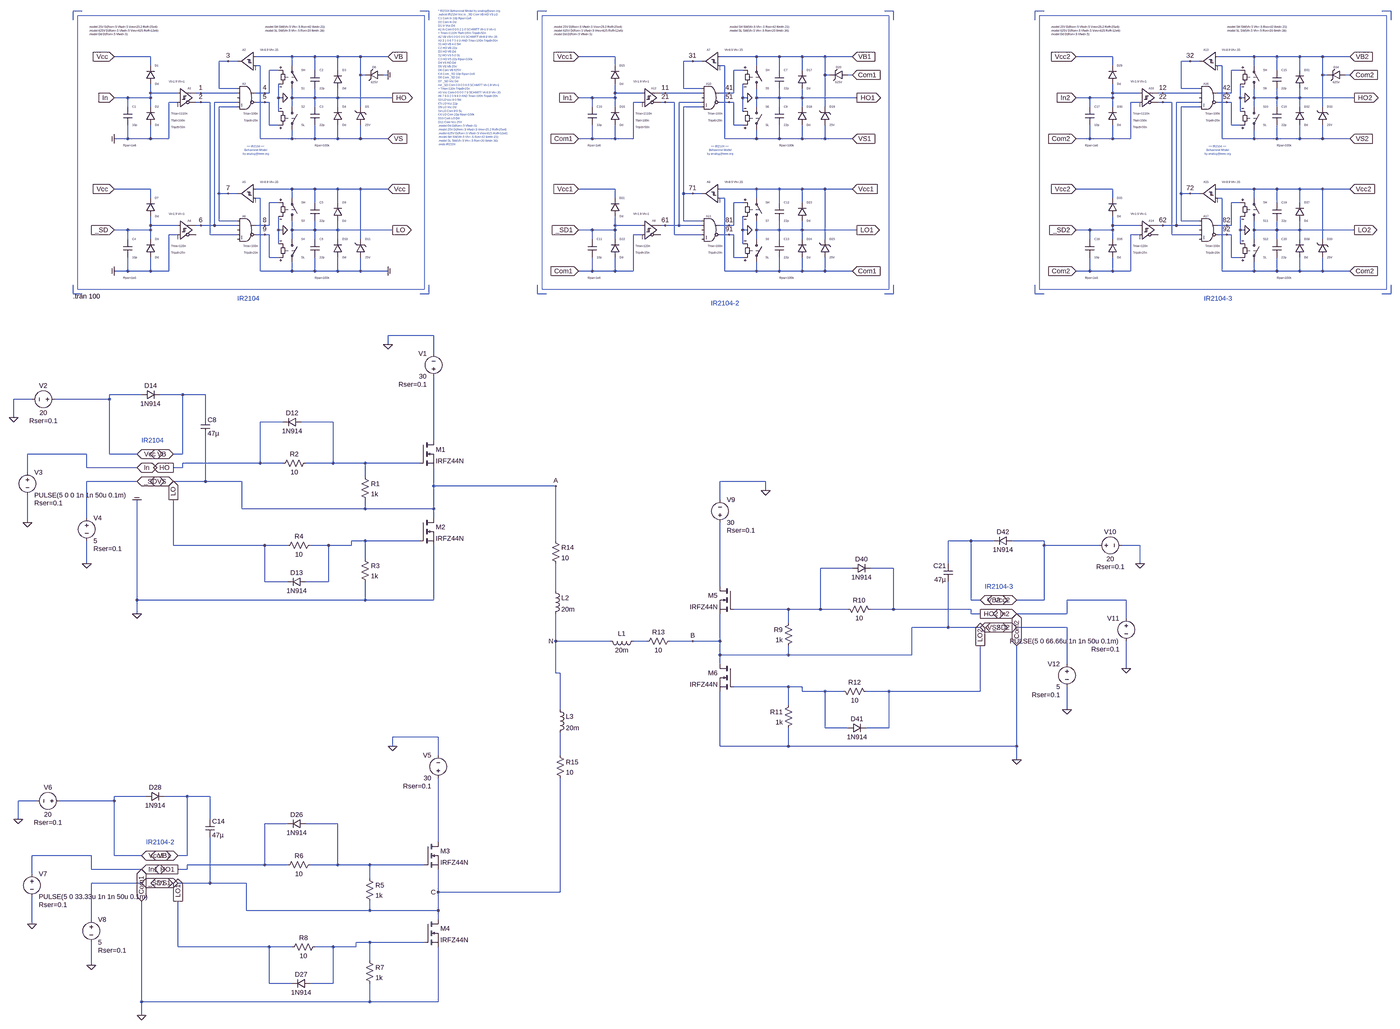
[diagram p0: schematic IR2104_11son hal.asc, whole sheet]
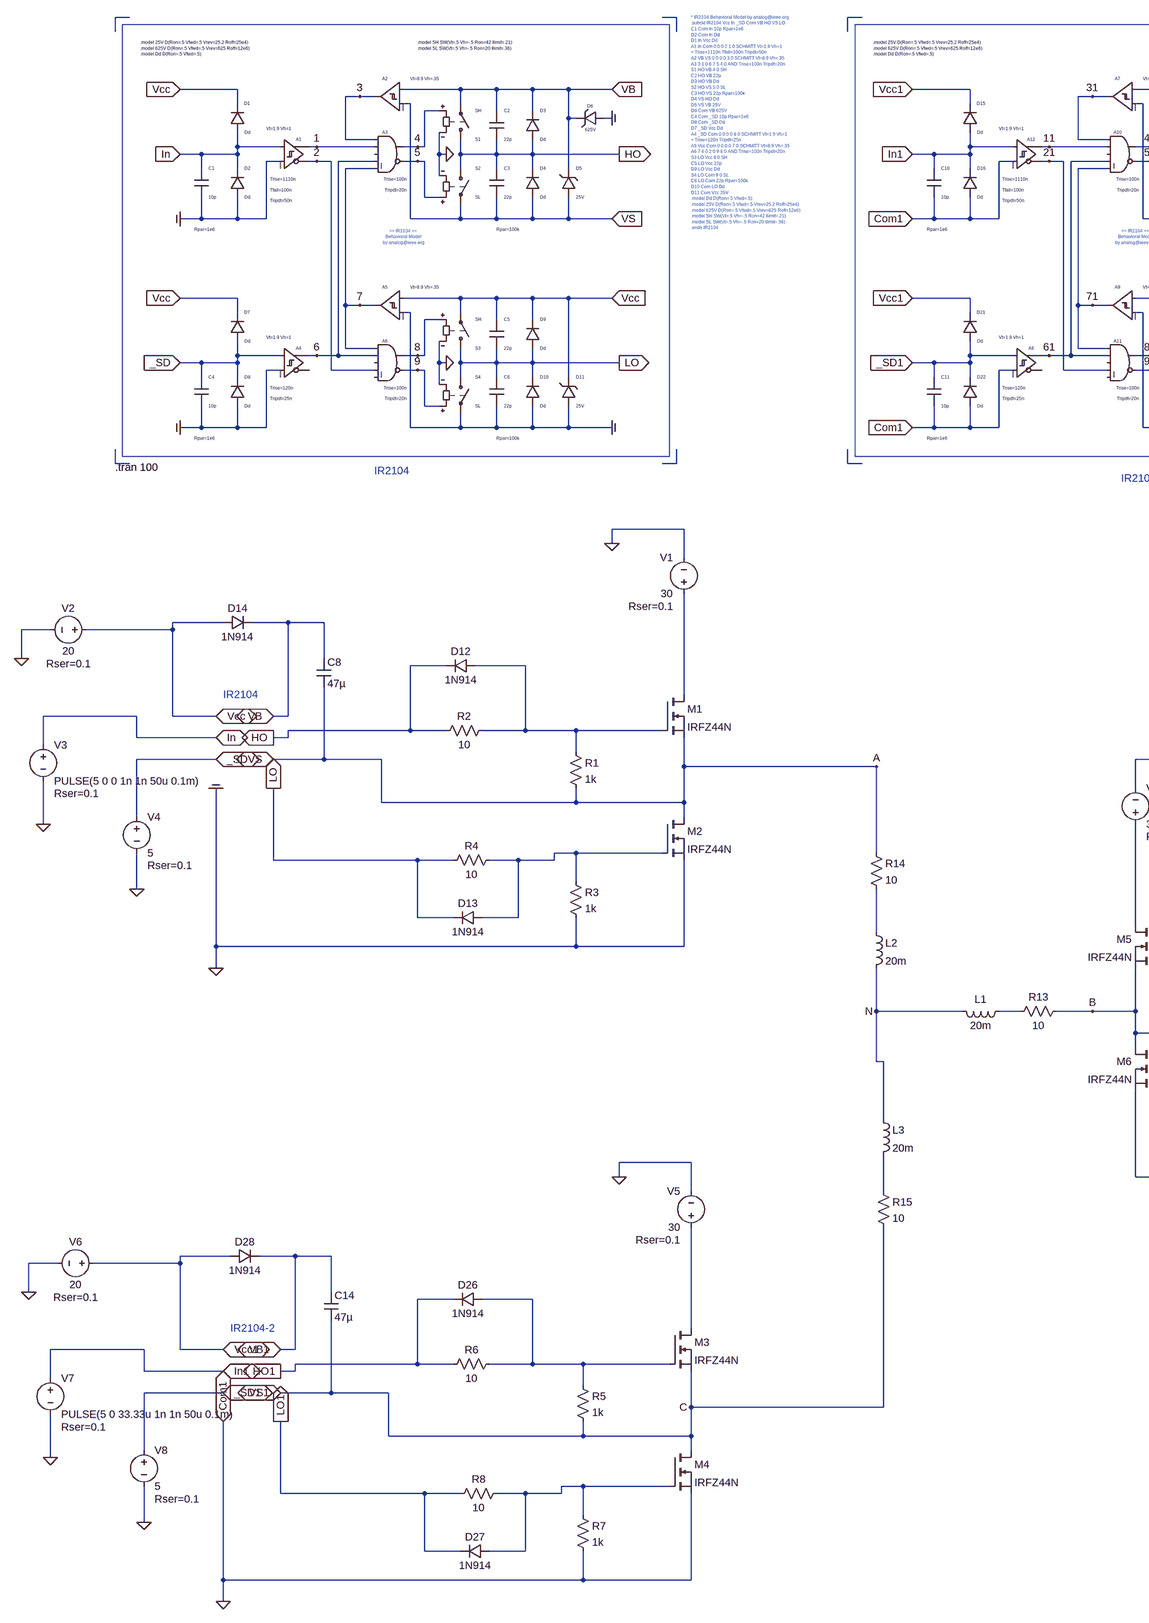
[diagram p1: schematic IR2104_11son hal.asc, part, row 1 of 1, column 1 of 2]
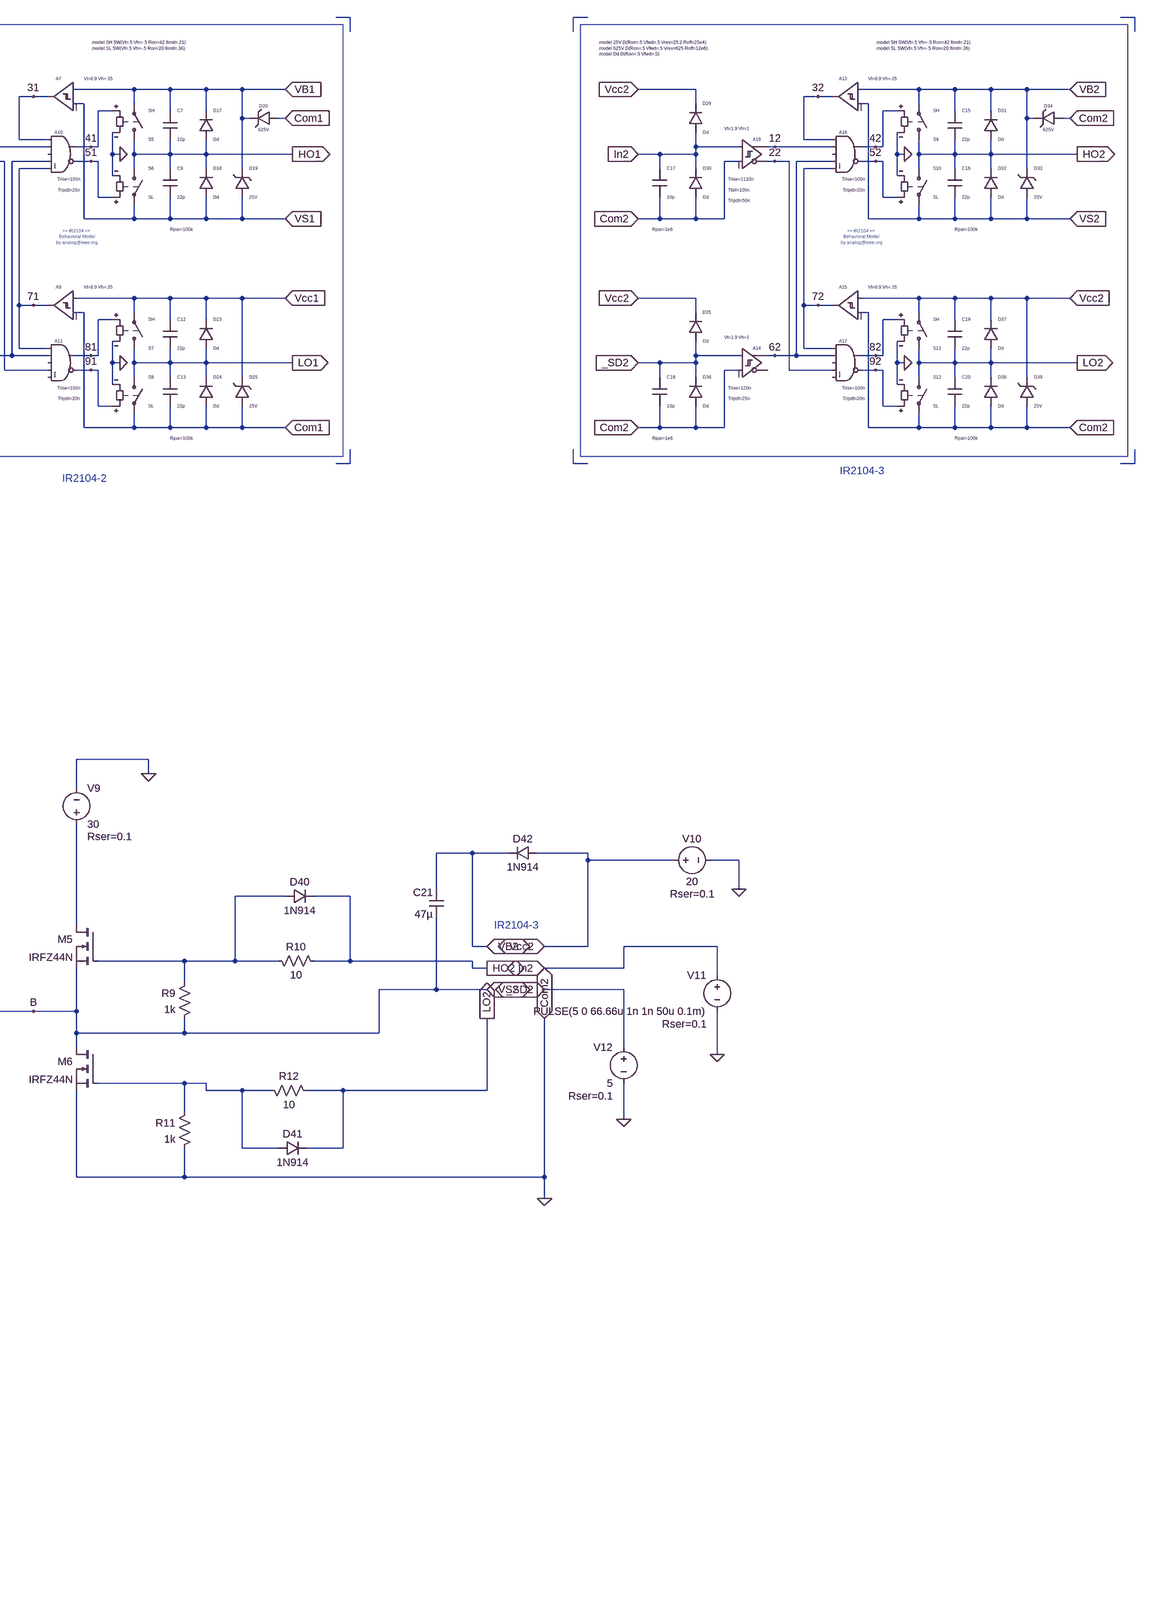
[diagram p2: schematic IR2104_11son hal.asc, part, row 1 of 1, column 2 of 2]
IR2104_11son hal.asc, the LTspice schematic file:
Version 4.1
SHEET 1 4404 2996
WIRE -368 -592 -400 -592
WIRE 848 -592 816 -592
WIRE 1440 -592 1408 -592
WIRE 2656 -592 2624 -592
WIRE 3184 -592 3152 -592
WIRE 4400 -592 4368 -592
WIRE -400 -560 -400 -592
WIRE 848 -560 848 -592
WIRE 1408 -560 1408 -592
WIRE 2656 -560 2656 -592
WIRE 3152 -560 3152 -592
WIRE 4400 -560 4400 -592
WIRE -128 -432 -256 -432
WIRE 368 -432 240 -432
WIRE 448 -432 368 -432
WIRE 528 -432 448 -432
WIRE 608 -432 528 -432
WIRE 704 -432 608 -432
WIRE 1680 -432 1552 -432
WIRE 2176 -432 2048 -432
WIRE 2256 -432 2176 -432
WIRE 2336 -432 2256 -432
WIRE 2416 -432 2336 -432
WIRE 2512 -432 2416 -432
WIRE 3424 -432 3296 -432
WIRE 3920 -432 3792 -432
WIRE 4000 -432 3920 -432
WIRE 4080 -432 4000 -432
WIRE 4160 -432 4080 -432
WIRE 4256 -432 4160 -432
WIRE 144 -416 112 -416
WIRE 176 -416 144 -416
WIRE 1952 -416 1920 -416
WIRE 1984 -416 1952 -416
WIRE 3696 -416 3664 -416
WIRE 3728 -416 3696 -416
WIRE -128 -400 -128 -432
WIRE 256 -400 240 -400
WIRE 368 -400 368 -432
WIRE 1680 -400 1680 -432
WIRE 2064 -400 2048 -400
WIRE 2176 -400 2176 -432
WIRE 3424 -400 3424 -432
WIRE 3808 -400 3792 -400
WIRE 3920 -400 3920 -432
WIRE 320 -384 288 -384
WIRE 448 -384 448 -432
WIRE 528 -384 528 -432
WIRE 2128 -384 2096 -384
WIRE 2256 -384 2256 -432
WIRE 2336 -384 2336 -432
WIRE 3872 -384 3840 -384
WIRE 4000 -384 4000 -432
WIRE 4080 -384 4080 -432
WIRE 608 -368 608 -432
WIRE 624 -368 608 -368
WIRE 704 -368 688 -368
WIRE 2416 -368 2416 -432
WIRE 2432 -368 2416 -368
WIRE 2512 -368 2496 -368
WIRE 4160 -368 4160 -432
WIRE 4176 -368 4160 -368
WIRE 4256 -368 4240 -368
WIRE 112 -320 112 -416
WIRE 176 -320 112 -320
WIRE 1920 -320 1920 -416
WIRE 1984 -320 1920 -320
WIRE 3664 -320 3664 -416
WIRE 3728 -320 3664 -320
WIRE -128 -304 -128 -336
WIRE -32 -304 -128 -304
WIRE 48 -304 32 -304
WIRE 176 -304 48 -304
WIRE 272 -304 240 -304
WIRE 288 -304 288 -384
WIRE 288 -304 272 -304
WIRE 1680 -304 1680 -336
WIRE 1776 -304 1680 -304
WIRE 1856 -304 1840 -304
WIRE 1984 -304 1856 -304
WIRE 2080 -304 2048 -304
WIRE 2096 -304 2096 -384
WIRE 2096 -304 2080 -304
WIRE 3424 -304 3424 -336
WIRE 3520 -304 3424 -304
WIRE 3600 -304 3584 -304
WIRE 3728 -304 3600 -304
WIRE 3824 -304 3792 -304
WIRE 3840 -304 3840 -384
WIRE 3840 -304 3824 -304
WIRE -208 -288 -256 -288
WIRE -128 -288 -128 -304
WIRE -128 -288 -208 -288
WIRE 320 -288 320 -336
WIRE 336 -288 320 -288
WIRE 368 -288 368 -320
WIRE 448 -288 448 -320
WIRE 448 -288 368 -288
WIRE 528 -288 528 -320
WIRE 528 -288 448 -288
WIRE 720 -288 528 -288
WIRE 1600 -288 1552 -288
WIRE 1680 -288 1680 -304
WIRE 1680 -288 1600 -288
WIRE 2128 -288 2128 -336
WIRE 2144 -288 2128 -288
WIRE 2176 -288 2176 -320
WIRE 2256 -288 2256 -320
WIRE 2256 -288 2176 -288
WIRE 2336 -288 2336 -320
WIRE 2336 -288 2256 -288
WIRE 2528 -288 2336 -288
WIRE 3344 -288 3296 -288
WIRE 3424 -288 3424 -304
WIRE 3424 -288 3344 -288
WIRE 3872 -288 3872 -336
WIRE 3888 -288 3872 -288
WIRE 3920 -288 3920 -320
WIRE 4000 -288 4000 -320
WIRE 4000 -288 3920 -288
WIRE 4080 -288 4080 -320
WIRE 4080 -288 4000 -288
WIRE 4272 -288 4080 -288
WIRE -32 -272 -64 -272
WIRE 48 -272 32 -272
WIRE 80 -272 48 -272
WIRE 176 -272 96 -272
WIRE 272 -272 240 -272
WIRE 288 -272 272 -272
WIRE 1776 -272 1744 -272
WIRE 1856 -272 1840 -272
WIRE 1888 -272 1856 -272
WIRE 1984 -272 1904 -272
WIRE 2080 -272 2048 -272
WIRE 2096 -272 2080 -272
WIRE 3520 -272 3488 -272
WIRE 3600 -272 3584 -272
WIRE 3632 -272 3600 -272
WIRE 3728 -272 3648 -272
WIRE 3824 -272 3792 -272
WIRE 3840 -272 3824 -272
WIRE -208 -256 -208 -288
WIRE -128 -256 -128 -288
WIRE 176 -256 112 -256
WIRE 368 -256 368 -288
WIRE 448 -256 448 -288
WIRE 528 -256 528 -288
WIRE 608 -256 608 -368
WIRE 1600 -256 1600 -288
WIRE 1680 -256 1680 -288
WIRE 1984 -256 1920 -256
WIRE 2176 -256 2176 -288
WIRE 2256 -256 2256 -288
WIRE 2336 -256 2336 -288
WIRE 2416 -256 2416 -368
WIRE 3344 -256 3344 -288
WIRE 3424 -256 3424 -288
WIRE 3728 -256 3664 -256
WIRE 3920 -256 3920 -288
WIRE 4000 -256 4000 -288
WIRE 4080 -256 4080 -288
WIRE 4160 -256 4160 -368
WIRE 320 -240 320 -288
WIRE 2128 -240 2128 -288
WIRE 3872 -240 3872 -288
WIRE 288 -192 288 -272
WIRE 320 -192 288 -192
WIRE 2096 -192 2096 -272
WIRE 2128 -192 2096 -192
WIRE 3840 -192 3840 -272
WIRE 3872 -192 3840 -192
WIRE -208 -144 -208 -192
WIRE -208 -144 -256 -144
WIRE -128 -144 -128 -192
WIRE -128 -144 -208 -144
WIRE -64 -144 -64 -272
WIRE -64 -144 -128 -144
WIRE 256 -144 256 -400
WIRE 368 -144 368 -176
WIRE 368 -144 256 -144
WIRE 448 -144 448 -192
WIRE 448 -144 368 -144
WIRE 528 -144 528 -192
WIRE 528 -144 448 -144
WIRE 608 -144 608 -192
WIRE 608 -144 528 -144
WIRE 704 -144 608 -144
WIRE 1600 -144 1600 -192
WIRE 1600 -144 1552 -144
WIRE 1680 -144 1680 -192
WIRE 1680 -144 1600 -144
WIRE 1744 -144 1744 -272
WIRE 1744 -144 1680 -144
WIRE 2064 -144 2064 -400
WIRE 2176 -144 2176 -176
WIRE 2176 -144 2064 -144
WIRE 2256 -144 2256 -192
WIRE 2256 -144 2176 -144
WIRE 2336 -144 2336 -192
WIRE 2336 -144 2256 -144
WIRE 2416 -144 2416 -192
WIRE 2416 -144 2336 -144
WIRE 2512 -144 2416 -144
WIRE 3344 -144 3344 -192
WIRE 3344 -144 3296 -144
WIRE 3424 -144 3424 -192
WIRE 3424 -144 3344 -144
WIRE 3488 -144 3488 -272
WIRE 3488 -144 3424 -144
WIRE 3808 -144 3808 -400
WIRE 3920 -144 3920 -176
WIRE 3920 -144 3808 -144
WIRE 4000 -144 4000 -192
WIRE 4000 -144 3920 -144
WIRE 4080 -144 4080 -192
WIRE 4080 -144 4000 -144
WIRE 4160 -144 4160 -192
WIRE 4160 -144 4080 -144
WIRE 4256 -144 4160 -144
WIRE -128 32 -256 32
WIRE 368 32 240 32
WIRE 448 32 368 32
WIRE 528 32 448 32
WIRE 608 32 528 32
WIRE 704 32 608 32
WIRE 1680 32 1552 32
WIRE 2176 32 2048 32
WIRE 2256 32 2176 32
WIRE 2336 32 2256 32
WIRE 2416 32 2336 32
WIRE 2512 32 2416 32
WIRE 3424 32 3296 32
WIRE 3920 32 3792 32
WIRE 4000 32 3920 32
WIRE 4080 32 4000 32
WIRE 4160 32 4080 32
WIRE 4256 32 4160 32
WIRE 112 48 112 -256
WIRE 144 48 112 48
WIRE 176 48 144 48
WIRE 1920 48 1920 -256
WIRE 1952 48 1920 48
WIRE 1984 48 1952 48
WIRE 3664 48 3664 -256
WIRE 3696 48 3664 48
WIRE 3728 48 3696 48
WIRE -128 64 -128 32
WIRE 256 64 240 64
WIRE 368 64 368 32
WIRE 1680 64 1680 32
WIRE 2064 64 2048 64
WIRE 2176 64 2176 32
WIRE 3424 64 3424 32
WIRE 3808 64 3792 64
WIRE 3920 64 3920 32
WIRE 320 80 288 80
WIRE 448 80 448 32
WIRE 528 80 528 32
WIRE 2128 80 2096 80
WIRE 2256 80 2256 32
WIRE 2336 80 2336 32
WIRE 3872 80 3840 80
WIRE 4000 80 4000 32
WIRE 4080 80 4080 32
WIRE 112 144 112 48
WIRE 176 144 112 144
WIRE 1920 144 1920 48
WIRE 1984 144 1920 144
WIRE 3664 144 3664 48
WIRE 3728 144 3664 144
WIRE -128 160 -128 128
WIRE -32 160 -128 160
WIRE 48 160 32 160
WIRE 96 160 96 -272
WIRE 96 160 48 160
WIRE 176 160 96 160
WIRE 272 160 240 160
WIRE 288 160 288 80
WIRE 288 160 272 160
WIRE 1680 160 1680 128
WIRE 1776 160 1680 160
WIRE 1856 160 1840 160
WIRE 1904 160 1904 -272
WIRE 1904 160 1856 160
WIRE 1984 160 1904 160
WIRE 2080 160 2048 160
WIRE 2096 160 2096 80
WIRE 2096 160 2080 160
WIRE 3424 160 3424 128
WIRE 3520 160 3424 160
WIRE 3600 160 3584 160
WIRE 3648 160 3648 -272
WIRE 3648 160 3600 160
WIRE 3728 160 3648 160
WIRE 3824 160 3792 160
WIRE 3840 160 3840 80
WIRE 3840 160 3824 160
WIRE -208 176 -256 176
WIRE -128 176 -128 160
WIRE -128 176 -208 176
WIRE 320 176 320 128
WIRE 336 176 320 176
WIRE 368 176 368 144
WIRE 448 176 448 144
WIRE 448 176 368 176
WIRE 528 176 528 144
WIRE 528 176 448 176
WIRE 720 176 528 176
WIRE 1600 176 1552 176
WIRE 1680 176 1680 160
WIRE 1680 176 1600 176
WIRE 2128 176 2128 128
WIRE 2144 176 2128 176
WIRE 2176 176 2176 144
WIRE 2256 176 2256 144
WIRE 2256 176 2176 176
WIRE 2336 176 2336 144
WIRE 2336 176 2256 176
WIRE 2528 176 2336 176
WIRE 3344 176 3296 176
WIRE 3424 176 3424 160
WIRE 3424 176 3344 176
WIRE 3872 176 3872 128
WIRE 3888 176 3872 176
WIRE 3920 176 3920 144
WIRE 4000 176 4000 144
WIRE 4000 176 3920 176
WIRE 4080 176 4080 144
WIRE 4080 176 4000 176
WIRE 4272 176 4080 176
WIRE -32 192 -64 192
WIRE 80 192 80 -272
WIRE 176 192 80 192
WIRE 272 192 240 192
WIRE 288 192 272 192
WIRE 1776 192 1744 192
WIRE 1888 192 1888 -272
WIRE 1984 192 1888 192
WIRE 2080 192 2048 192
WIRE 2096 192 2080 192
WIRE 3520 192 3488 192
WIRE 3632 192 3632 -272
WIRE 3728 192 3632 192
WIRE 3824 192 3792 192
WIRE 3840 192 3824 192
WIRE -208 208 -208 176
WIRE -128 208 -128 176
WIRE 368 208 368 176
WIRE 448 208 448 176
WIRE 528 208 528 176
WIRE 608 208 608 32
WIRE 1600 208 1600 176
WIRE 1680 208 1680 176
WIRE 2176 208 2176 176
WIRE 2256 208 2256 176
WIRE 2336 208 2336 176
WIRE 2416 208 2416 32
WIRE 3344 208 3344 176
WIRE 3424 208 3424 176
WIRE 3920 208 3920 176
WIRE 4000 208 4000 176
WIRE 4080 208 4080 176
WIRE 4160 208 4160 32
WIRE 320 224 320 176
WIRE 2128 224 2128 176
WIRE 3872 224 3872 176
WIRE 288 272 288 192
WIRE 320 272 288 272
WIRE 2096 272 2096 192
WIRE 2128 272 2096 272
WIRE 3840 272 3840 192
WIRE 3872 272 3840 272
WIRE -208 320 -208 272
WIRE -208 320 -256 320
WIRE -128 320 -128 272
WIRE -128 320 -208 320
WIRE -64 320 -64 192
WIRE -64 320 -128 320
WIRE 256 320 256 64
WIRE 368 320 368 288
WIRE 368 320 256 320
WIRE 448 320 448 272
WIRE 448 320 368 320
WIRE 528 320 528 272
WIRE 528 320 448 320
WIRE 608 320 608 272
WIRE 608 320 528 320
WIRE 704 320 608 320
WIRE 1600 320 1600 272
WIRE 1600 320 1552 320
WIRE 1680 320 1680 272
WIRE 1680 320 1600 320
WIRE 1744 320 1744 192
WIRE 1744 320 1680 320
WIRE 2064 320 2064 64
WIRE 2176 320 2176 288
WIRE 2176 320 2064 320
WIRE 2256 320 2256 272
WIRE 2256 320 2176 320
WIRE 2336 320 2336 272
WIRE 2336 320 2256 320
WIRE 2416 320 2416 272
WIRE 2416 320 2336 320
WIRE 2512 320 2416 320
WIRE 3344 320 3344 272
WIRE 3344 320 3296 320
WIRE 3424 320 3424 272
WIRE 3424 320 3344 320
WIRE 3488 320 3488 192
WIRE 3488 320 3424 320
WIRE 3808 320 3808 64
WIRE 3920 320 3920 288
WIRE 3920 320 3808 320
WIRE 4000 320 4000 272
WIRE 4000 320 3920 320
WIRE 4080 320 4080 272
WIRE 4080 320 4000 320
WIRE 4160 320 4160 272
WIRE 4160 320 4080 320
WIRE 4256 320 4160 320
WIRE -400 400 -400 368
WIRE -368 400 -400 400
WIRE 848 400 848 368
WIRE 848 400 816 400
WIRE 1408 400 1408 368
WIRE 1440 400 1408 400
WIRE 2656 400 2656 368
WIRE 2656 400 2624 400
WIRE 3152 400 3152 368
WIRE 3184 400 3152 400
WIRE 4400 400 4400 368
WIRE 4400 400 4368 400
WIRE 864 592 704 592
WIRE 704 624 704 592
WIRE 864 656 864 592
WIRE -160 800 -272 800
WIRE -16 800 -96 800
WIRE 64 800 -16 800
WIRE -544 816 -608 816
WIRE -272 816 -272 800
WIRE -272 816 -464 816
WIRE -608 880 -608 816
WIRE 64 880 64 800
WIRE 336 896 256 896
WIRE 512 896 400 896
WIRE 864 960 864 736
WIRE -352 1008 -560 1008
WIRE -272 1008 -272 816
WIRE -176 1008 -272 1008
WIRE -16 1008 -16 800
WIRE -16 1008 -48 1008
WIRE 256 1040 256 896
WIRE 256 1040 -16 1040
WIRE 336 1040 256 1040
WIRE 512 1040 512 896
WIRE 512 1040 416 1040
WIRE 624 1040 512 1040
WIRE 816 1040 624 1040
WIRE -352 1056 -352 1008
WIRE -176 1056 -352 1056
WIRE -16 1056 -16 1040
WIRE -16 1056 -48 1056
WIRE -560 1072 -560 1008
WIRE 624 1088 624 1040
WIRE -176 1104 -352 1104
WIRE 64 1104 64 944
WIRE 64 1104 -48 1104
WIRE 192 1104 64 1104
WIRE 2208 1104 2048 1104
WIRE 864 1120 864 1056
WIRE 1472 1120 864 1120
WIRE 2208 1136 2208 1104
WIRE 2048 1168 2048 1104
WIRE 192 1200 192 1104
WIRE 624 1200 624 1168
WIRE 624 1200 192 1200
WIRE 864 1200 864 1120
WIRE 864 1200 624 1200
WIRE -352 1232 -352 1104
WIRE 864 1232 864 1200
WIRE -560 1248 -560 1152
WIRE 624 1312 576 1312
WIRE 816 1312 624 1312
WIRE 1472 1312 1472 1120
WIRE 2928 1312 2848 1312
WIRE 3008 1312 2928 1312
WIRE 3184 1312 3072 1312
WIRE -48 1328 -48 1168
WIRE 272 1328 -48 1328
WIRE 352 1328 272 1328
WIRE 496 1328 432 1328
WIRE 576 1328 576 1312
WIRE 576 1328 496 1328
WIRE 3184 1328 3184 1312
WIRE 3376 1328 3184 1328
WIRE 3520 1328 3456 1328
WIRE 624 1376 624 1312
WIRE -352 1392 -352 1312
WIRE 2848 1392 2848 1312
WIRE 3520 1392 3520 1328
WIRE 2512 1408 2400 1408
WIRE 2656 1408 2576 1408
WIRE 272 1456 272 1328
WIRE 352 1456 272 1456
WIRE 496 1456 496 1328
WIRE 496 1456 416 1456
WIRE 2048 1472 2048 1248
WIRE 1472 1488 1472 1392
WIRE -176 1520 -176 1168
WIRE 624 1520 624 1456
WIRE 624 1520 -176 1520
WIRE 864 1520 864 1328
WIRE 864 1520 624 1520
WIRE 2928 1520 2928 1312
WIRE 2960 1520 2928 1520
WIRE 3184 1520 3184 1328
WIRE 3184 1520 3088 1520
WIRE 3472 1520 3264 1520
WIRE 2288 1552 2096 1552
WIRE 2400 1552 2400 1408
WIRE 2400 1552 2288 1552
WIRE 2496 1552 2400 1552
WIRE 2656 1552 2656 1408
WIRE 2656 1552 2576 1552
WIRE 2928 1552 2656 1552
WIRE -176 1568 -176 1520
WIRE 2928 1568 2928 1552
WIRE 2960 1568 2928 1568
WIRE 3264 1568 3264 1520
WIRE 3264 1568 3088 1568
WIRE 3472 1584 3472 1520
WIRE 2288 1600 2288 1552
WIRE 2848 1616 2848 1456
WIRE 2848 1616 2720 1616
WIRE 2960 1616 2848 1616
WIRE 3264 1616 3088 1616
WIRE 1472 1664 1472 1568
WIRE 1664 1664 1472 1664
WIRE 1792 1664 1744 1664
WIRE 1952 1664 1872 1664
WIRE 2048 1664 2048 1568
WIRE 2048 1664 1952 1664
WIRE 2048 1712 2048 1664
WIRE 2288 1712 2288 1680
WIRE 2288 1712 2048 1712
WIRE 2720 1712 2720 1616
WIRE 2720 1712 2288 1712
WIRE 2048 1744 2048 1712
WIRE 3264 1744 3264 1616
WIRE 3472 1760 3472 1664
WIRE 1472 1776 1472 1664
WIRE 1488 1776 1472 1776
WIRE 2288 1824 2096 1824
WIRE 2336 1824 2288 1824
WIRE 2336 1840 2336 1824
WIRE 2416 1840 2336 1840
WIRE 2480 1840 2416 1840
WIRE 2640 1840 2560 1840
WIRE 2960 1840 2960 1680
WIRE 2960 1840 2640 1840
WIRE 2288 1888 2288 1824
WIRE 1488 1904 1488 1776
WIRE 3264 1904 3264 1824
WIRE 2416 1968 2416 1840
WIRE 2496 1968 2416 1968
WIRE 2640 1968 2640 1840
WIRE 2640 1968 2560 1968
WIRE 880 2000 720 2000
WIRE 720 2032 720 2000
WIRE 2048 2032 2048 1840
WIRE 2288 2032 2288 1968
WIRE 2288 2032 2048 2032
WIRE 3088 2032 3088 1680
WIRE 3088 2032 2288 2032
WIRE 880 2064 880 2000
WIRE 1488 2064 1488 1984
WIRE 3088 2080 3088 2032
WIRE -144 2208 -256 2208
WIRE 0 2208 -80 2208
WIRE 80 2208 0 2208
WIRE -528 2224 -592 2224
WIRE -256 2224 -256 2208
WIRE -256 2224 -448 2224
WIRE -592 2288 -592 2224
WIRE 80 2288 80 2208
WIRE 352 2304 272 2304
WIRE 528 2304 416 2304
WIRE 880 2368 880 2144
WIRE -336 2416 -544 2416
WIRE -256 2416 -256 2224
WIRE -160 2416 -256 2416
WIRE 0 2416 0 2208
WIRE 0 2416 -32 2416
WIRE 272 2448 272 2304
WIRE 272 2448 0 2448
WIRE 352 2448 272 2448
WIRE 528 2448 528 2304
WIRE 528 2448 432 2448
WIRE 640 2448 528 2448
WIRE 832 2448 640 2448
WIRE -336 2464 -336 2416
WIRE -160 2464 -336 2464
WIRE 0 2464 0 2448
WIRE 0 2464 -32 2464
WIRE -544 2480 -544 2416
WIRE 640 2496 640 2448
WIRE -160 2512 -336 2512
WIRE 80 2512 80 2352
WIRE 80 2512 -32 2512
WIRE 208 2512 80 2512
WIRE 880 2544 880 2464
WIRE 1488 2544 1488 2144
WIRE 1488 2544 880 2544
WIRE 208 2608 208 2512
WIRE 640 2608 640 2576
WIRE 640 2608 208 2608
WIRE 880 2608 880 2544
WIRE 880 2608 640 2608
WIRE -336 2640 -336 2512
WIRE 880 2640 880 2608
WIRE -544 2656 -544 2560
WIRE 640 2720 592 2720
WIRE 832 2720 640 2720
WIRE -32 2736 -32 2576
WIRE 288 2736 -32 2736
WIRE 368 2736 288 2736
WIRE 512 2736 448 2736
WIRE 592 2736 592 2720
WIRE 592 2736 512 2736
WIRE 640 2784 640 2720
WIRE -336 2800 -336 2720
WIRE 288 2864 288 2736
WIRE 368 2864 288 2864
WIRE 512 2864 512 2736
WIRE 512 2864 432 2864
WIRE -160 2928 -160 2576
WIRE 640 2928 640 2864
WIRE 640 2928 -160 2928
WIRE 880 2928 880 2736
WIRE 880 2928 640 2928
WIRE -160 2976 -160 2928
FLAG 720 -288 HO
IOPIN 720 -288 Out
FLAG -256 -288 In
IOPIN -256 -288 In
FLAG -256 -432 Vcc
IOPIN -256 -432 In
FLAG 704 -432 VB
IOPIN 704 -432 In
FLAG 704 -144 VS
IOPIN 704 -144 In
FLAG -256 -144 Com
IOPIN -256 -144 In
FLAG 704 -368 Com
IOPIN 704 -368 In
FLAG -256 176 _SD
IOPIN -256 176 In
FLAG -256 32 Vcc
IOPIN -256 32 In
FLAG -256 320 Com
IOPIN -256 320 In
FLAG 704 32 Vcc
IOPIN 704 32 In
FLAG 704 320 Com
IOPIN 704 320 In
FLAG 720 176 LO
IOPIN 720 176 Out
FLAG 48 -304 1
FLAG 48 -272 2
FLAG 144 -416 3
FLAG 336 176 0
FLAG 336 -288 0
FLAG 144 48 7
FLAG 272 -304 4
FLAG 272 -272 5
FLAG 48 160 6
FLAG 272 160 8
FLAG 272 192 9
FLAG -176 1008 Vcc
IOPIN -176 1008 BiDir
FLAG -176 1056 In
IOPIN -176 1056 BiDir
FLAG -176 1104 _SD
IOPIN -176 1104 BiDir
FLAG -176 1168 Com
IOPIN -176 1168 BiDir
FLAG -48 1008 VB
IOPIN -48 1008 BiDir
FLAG -48 1056 HO
IOPIN -48 1056 Out
FLAG -48 1104 VS
IOPIN -48 1104 BiDir
FLAG -48 1168 LO
IOPIN -48 1168 Out
FLAG -608 880 0
FLAG 704 624 0
FLAG -560 1248 0
FLAG -352 1392 0
FLAG -176 1568 0
FLAG 2528 -288 HO1
IOPIN 2528 -288 Out
FLAG 1552 -288 In1
IOPIN 1552 -288 In
FLAG 1552 -432 Vcc1
IOPIN 1552 -432 In
FLAG 2512 -432 VB1
IOPIN 2512 -432 In
FLAG 2512 -144 VS1
IOPIN 2512 -144 In
FLAG 1552 -144 Com1
IOPIN 1552 -144 In
FLAG 2512 -368 Com1
IOPIN 2512 -368 In
FLAG 1552 176 _SD1
IOPIN 1552 176 In
FLAG 1552 32 Vcc1
IOPIN 1552 32 In
FLAG 1552 320 Com1
IOPIN 1552 320 In
FLAG 2512 32 Vcc1
IOPIN 2512 32 In
FLAG 2512 320 Com1
IOPIN 2512 320 In
FLAG 2528 176 LO1
IOPIN 2528 176 Out
FLAG 1856 -304 11
FLAG 1856 -272 21
FLAG 1952 -416 31
FLAG 2144 176 0
FLAG 2144 -288 0
FLAG 1952 48 71
FLAG 2080 -304 41
FLAG 2080 -272 51
FLAG 1856 160 61
FLAG 2080 160 81
FLAG 2080 192 91
FLAG -160 2416 Vcc1
IOPIN -160 2416 BiDir
FLAG -160 2464 In1
IOPIN -160 2464 BiDir
FLAG -160 2512 _SD1
IOPIN -160 2512 BiDir
FLAG -160 2576 Com1
IOPIN -160 2576 BiDir
FLAG -32 2416 VB1
IOPIN -32 2416 BiDir
FLAG -32 2464 HO1
IOPIN -32 2464 Out
FLAG -32 2512 VS1
IOPIN -32 2512 BiDir
FLAG -32 2576 LO1
IOPIN -32 2576 Out
FLAG -592 2288 0
FLAG 720 2032 0
FLAG -544 2656 0
FLAG -336 2800 0
FLAG -160 2976 0
FLAG 4272 -288 HO2
IOPIN 4272 -288 Out
FLAG 3296 -288 In2
IOPIN 3296 -288 In
FLAG 3296 -432 Vcc2
IOPIN 3296 -432 In
FLAG 4256 -432 VB2
IOPIN 4256 -432 In
FLAG 4256 -144 VS2
IOPIN 4256 -144 In
FLAG 3296 -144 Com2
IOPIN 3296 -144 In
FLAG 4256 -368 Com2
IOPIN 4256 -368 In
FLAG 3296 176 _SD2
IOPIN 3296 176 In
FLAG 3296 32 Vcc2
IOPIN 3296 32 In
FLAG 3296 320 Com2
IOPIN 3296 320 In
FLAG 4256 32 Vcc2
IOPIN 4256 32 In
FLAG 4256 320 Com2
IOPIN 4256 320 In
FLAG 4272 176 LO2
IOPIN 4272 176 Out
FLAG 3600 -304 12
FLAG 3600 -272 22
FLAG 3696 -416 32
FLAG 3888 176 0
FLAG 3888 -288 0
FLAG 3696 48 72
FLAG 3824 -304 42
FLAG 3824 -272 52
FLAG 3600 160 62
FLAG 3824 160 82
FLAG 3824 192 92
FLAG 3088 1520 Vcc2
IOPIN 3088 1520 BiDir
FLAG 3088 1568 In2
IOPIN 3088 1568 BiDir
FLAG 3088 1616 _SD2
IOPIN 3088 1616 BiDir
FLAG 3088 1680 Com2
IOPIN 3088 1680 BiDir
FLAG 2960 1520 VB2
IOPIN 2960 1520 BiDir
FLAG 2960 1568 HO2
IOPIN 2960 1568 Out
FLAG 2960 1616 VS2
IOPIN 2960 1616 BiDir
FLAG 2960 1680 LO2
IOPIN 2960 1680 Out
FLAG 3520 1392 0
FLAG 2208 1136 0
FLAG 3472 1760 0
FLAG 3264 1904 0
FLAG 3088 2080 0
FLAG 1472 1664 N
FLAG 1472 1120 A
FLAG 1952 1664 B
FLAG 880 2544 C
SYMBOL diode -144 -336 M180
WINDOW 0 31 64 Left 0
WINDOW 3 32 0 Left 0
SYMATTR InstName D1
SYMATTR Value Dd
SYMBOL diode -144 -192 M180
WINDOW 0 32 64 Left 0
WINDOW 3 32 0 Left 0
SYMATTR InstName D2
SYMATTR Value Dd
SYMBOL diode 512 -320 M180
WINDOW 0 32 64 Left 0
WINDOW 3 32 0 Left 0
SYMATTR InstName D3
SYMATTR Value Dd
SYMBOL diode 512 -192 M180
WINDOW 0 32 64 Left 0
WINDOW 3 32 0 Left 0
SYMATTR InstName D4
SYMATTR Value Dd
SYMBOL zener 592 -192 M180
WINDOW 0 32 64 Left 0
WINDOW 3 32 0 Left 0
SYMATTR InstName D5
SYMATTR Value 25V
SYMBOL cap 432 -384 R0
WINDOW 0 32 0 Left 0
WINDOW 3 32 64 Left 0
SYMATTR InstName C2
SYMATTR Value 22p
SYMBOL cap 432 -256 R0
WINDOW 0 32 0 Left 0
WINDOW 3 32 64 Left 0
WINDOW 39 16 136 Left 0
SYMATTR InstName C3
SYMATTR Value 22p
SYMATTR SpiceLine Rpar=100k
SYMBOL sw 368 -304 M180
WINDOW 0 32 16 Left 0
WINDOW 3 32 80 Left 0
SYMATTR InstName S1
SYMATTR Value SH
SYMBOL sw 368 -272 R0
WINDOW 0 32 16 Left 0
WINDOW 3 32 80 Left 0
SYMATTR InstName S2
SYMATTR Value SL
SYMBOL Digital\\diffschmtbuf 240 -480 M0
WINDOW 0 40 25 Center 0
WINDOW 3 -16 25 Right 0
SYMATTR InstName A2
SYMATTR Value Vt=8.9 Vh=.35
SYMBOL cap -224 -256 R0
WINDOW 0 32 0 Left 0
WINDOW 3 32 64 Left 0
WINDOW 39 0 136 Left 0
SYMATTR InstName C1
SYMATTR Value 10p
SYMATTR SpiceLine Rpar=1e6
SYMBOL zener 688 -352 M270
WINDOW 0 36 32 VTop 0
WINDOW 3 -4 32 VBottom 0
SYMATTR InstName D6
SYMATTR Value 625V
SYMBOL diode -144 128 M180
WINDOW 0 31 64 Left 0
WINDOW 3 32 0 Left 0
SYMATTR InstName D7
SYMATTR Value Dd
SYMBOL diode -144 272 M180
WINDOW 0 32 64 Left 0
WINDOW 3 32 0 Left 0
SYMATTR InstName D8
SYMATTR Value Dd
SYMBOL Digital\\diffschmitt -32 112 R0
WINDOW 0 40 32 Center 0
WINDOW 3 -32 8 Left 0
WINDOW 123 -24 120 Left 0
WINDOW 39 -24 144 Left 0
SYMATTR InstName A4
SYMATTR Value Vt=1.9 Vh=1
SYMATTR Value2 Trise=120n
SYMATTR SpiceLine Tripdt=25n
SYMBOL Digital\\diffschmtbuf 240 -16 M0
WINDOW 0 40 24 Center 0
WINDOW 3 -16 24 Right 0
SYMATTR InstName A5
SYMATTR Value Vt=8.9 Vh=.35
SYMBOL cap -224 208 R0
WINDOW 0 32 0 Left 0
WINDOW 3 32 64 Left 0
WINDOW 39 0 136 Left 0
SYMATTR InstName C4
SYMATTR Value 10p
SYMATTR SpiceLine Rpar=1e6
SYMBOL sw 368 160 M180
WINDOW 0 32 16 Left 0
WINDOW 3 32 80 Left 0
SYMATTR InstName S3
SYMATTR Value SH
SYMBOL sw 368 192 R0
WINDOW 0 32 16 Left 0
WINDOW 3 32 80 Left 0
SYMATTR InstName S4
SYMATTR Value SL
SYMBOL diode 512 144 M180
WINDOW 0 32 64 Left 0
WINDOW 3 32 0 Left 0
SYMATTR InstName D9
SYMATTR Value Dd
SYMBOL diode 512 272 M180
WINDOW 0 32 64 Left 0
WINDOW 3 32 0 Left 0
SYMATTR InstName D10
SYMATTR Value Dd
SYMBOL zener 592 272 M180
WINDOW 0 32 64 Left 0
WINDOW 3 32 0 Left 0
SYMATTR InstName D11
SYMATTR Value 25V
SYMBOL cap 432 80 R0
WINDOW 0 32 0 Left 0
WINDOW 3 32 64 Left 0
SYMATTR InstName C5
SYMATTR Value 22p
SYMBOL cap 432 208 R0
WINDOW 0 32 0 Left 0
WINDOW 3 32 64 Left 0
WINDOW 39 16 136 Left 0
SYMATTR InstName C6
SYMATTR Value 22p
SYMATTR SpiceLine Rpar=100k
SYMBOL Digital\\and 208 -352 R0
WINDOW 0 -8 16 Center 0
WINDOW 3 40 120 Right 0
WINDOW 123 40 144 Right 0
SYMATTR InstName A3
SYMATTR Value Trise=100n
SYMATTR Value2 Tripdt=20n
SYMBOL Digital\\and 208 112 R0
WINDOW 0 -8 16 Center 0
WINDOW 3 40 120 Right 0
WINDOW 123 40 144 Right 0
SYMATTR InstName A6
SYMATTR Value Trise=100n
SYMATTR Value2 Tripdt=20n
SYMBOL Digital\\diffschmitt -32 -352 R0
WINDOW 0 40 32 Center 0
WINDOW 3 -32 8 Left 0
WINDOW 123 -24 120 Left 0
WINDOW 39 -24 144 Left 0
WINDOW 40 -24 168 Left 0
SYMATTR InstName A1
SYMATTR Value Vt=1.9 Vh=1
SYMATTR Value2 Trise=1110n
SYMATTR SpiceLine Tfall=100n
SYMATTR SpiceLine2 Tripdt=50n
SYMBOL nmos 816 960 R0
SYMATTR InstName M1
SYMATTR Value IRFZ44N
SYMBOL nmos 816 1232 R0
SYMATTR InstName M2
SYMATTR Value IRFZ44N
SYMBOL res 608 1072 R0
SYMATTR InstName R1
SYMATTR Value 1k
SYMBOL res 432 1024 R90
WINDOW 0 0 56 VBottom 2
WINDOW 3 32 56 VTop 2
SYMATTR InstName R2
SYMATTR Value 10
SYMBOL diode 400 880 R90
WINDOW 0 0 32 VBottom 2
WINDOW 3 32 32 VTop 2
SYMATTR InstName D12
SYMATTR Value 1N914
SYMBOL res 608 1360 R0
SYMATTR InstName R3
SYMATTR Value 1k
SYMBOL res 448 1312 R90
WINDOW 0 0 56 VBottom 2
WINDOW 3 32 56 VTop 2
SYMATTR InstName R4
SYMATTR Value 10
SYMBOL diode 416 1440 R90
WINDOW 0 0 32 VBottom 2
WINDOW 3 32 32 VTop 2
SYMATTR InstName D13
SYMATTR Value 1N914
SYMBOL diode -160 816 R270
WINDOW 0 32 32 VTop 2
WINDOW 3 0 32 VBottom 2
SYMATTR InstName D14
SYMATTR Value 1N914
SYMBOL voltage 864 752 R180
WINDOW 0 24 96 Left 2
WINDOW 3 24 16 Left 2
WINDOW 123 0 0 Left 0
WINDOW 39 24 -12 Left 2
SYMATTR InstName V1
SYMATTR Value 30
SYMATTR SpiceLine Rser=0.1
SYMBOL voltage -448 816 R90
WINDOW 0 -32 56 VBottom 2
WINDOW 3 32 56 VTop 2
WINDOW 123 0 0 Left 0
WINDOW 39 60 56 VTop 2
SYMATTR InstName V2
SYMATTR Value 20
SYMATTR SpiceLine Rser=0.1
SYMBOL voltage -560 1056 R0
WINDOW 123 0 0 Left 0
WINDOW 39 24 124 Left 2
SYMATTR SpiceLine Rser=0.1
SYMATTR InstName V3
SYMATTR Value PULSE(5 0 0 1n 1n 50u 0.1m)
SYMBOL voltage -352 1216 R0
WINDOW 123 0 0 Left 0
WINDOW 39 24 124 Left 2
SYMATTR SpiceLine Rser=0.1
SYMATTR InstName V4
SYMATTR Value 5
SYMBOL cap 48 880 R0
SYMATTR Value 47µ
SYMATTR InstName C8
SYMATTR SpiceLine V=12.5 Irms=3.53553 Rser=0.02 Lser=0 mfg="KEMET" pn="A700D476M12RATE020" type="Al electrolytic"
SYMBOL diode 1664 -336 M180
WINDOW 0 31 64 Left 0
WINDOW 3 32 0 Left 0
SYMATTR InstName D15
SYMATTR Value Dd
SYMBOL diode 1664 -192 M180
WINDOW 0 32 64 Left 0
WINDOW 3 32 0 Left 0
SYMATTR InstName D16
SYMATTR Value Dd
SYMBOL diode 2320 -320 M180
WINDOW 0 32 64 Left 0
WINDOW 3 32 0 Left 0
SYMATTR InstName D17
SYMATTR Value Dd
SYMBOL diode 2320 -192 M180
WINDOW 0 32 64 Left 0
WINDOW 3 32 0 Left 0
SYMATTR InstName D18
SYMATTR Value Dd
SYMBOL zener 2400 -192 M180
WINDOW 0 32 64 Left 0
WINDOW 3 32 0 Left 0
SYMATTR InstName D19
SYMATTR Value 25V
SYMBOL cap 2240 -384 R0
WINDOW 0 32 0 Left 0
WINDOW 3 32 64 Left 0
SYMATTR InstName C7
SYMATTR Value 22p
SYMBOL cap 2240 -256 R0
WINDOW 0 32 0 Left 0
WINDOW 3 32 64 Left 0
WINDOW 39 16 136 Left 0
SYMATTR InstName C9
SYMATTR Value 22p
SYMATTR SpiceLine Rpar=100k
SYMBOL sw 2176 -304 M180
WINDOW 0 32 16 Left 0
WINDOW 3 32 80 Left 0
SYMATTR InstName S5
SYMATTR Value SH
SYMBOL sw 2176 -272 R0
WINDOW 0 32 16 Left 0
WINDOW 3 32 80 Left 0
SYMATTR InstName S6
SYMATTR Value SL
SYMBOL Digital\\diffschmtbuf 2048 -480 M0
WINDOW 0 40 25 Center 0
WINDOW 3 -16 25 Right 0
SYMATTR InstName A7
SYMATTR Value Vt=8.9 Vh=.35
SYMBOL cap 1584 -256 R0
WINDOW 0 32 0 Left 0
WINDOW 3 32 64 Left 0
WINDOW 39 0 136 Left 0
SYMATTR InstName C10
SYMATTR Value 10p
SYMATTR SpiceLine Rpar=1e6
SYMBOL zener 2496 -352 M270
WINDOW 0 36 32 VTop 0
WINDOW 3 -4 32 VBottom 0
SYMATTR InstName D20
SYMATTR Value 625V
SYMBOL diode 1664 128 M180
WINDOW 0 31 64 Left 0
WINDOW 3 32 0 Left 0
SYMATTR InstName D21
SYMATTR Value Dd
SYMBOL diode 1664 272 M180
WINDOW 0 32 64 Left 0
WINDOW 3 32 0 Left 0
SYMATTR InstName D22
SYMATTR Value Dd
SYMBOL Digital\\diffschmitt 1776 112 R0
WINDOW 0 40 32 Center 0
WINDOW 3 -32 8 Left 0
WINDOW 123 -24 120 Left 0
WINDOW 39 -24 144 Left 0
SYMATTR InstName A8
SYMATTR Value Vt=1.9 Vh=1
SYMATTR Value2 Trise=120n
SYMATTR SpiceLine Tripdt=25n
SYMBOL Digital\\diffschmtbuf 2048 -16 M0
WINDOW 0 40 24 Center 0
WINDOW 3 -16 24 Right 0
SYMATTR InstName A9
SYMATTR Value Vt=8.9 Vh=.35
SYMBOL cap 1584 208 R0
WINDOW 0 32 0 Left 0
WINDOW 3 32 64 Left 0
WINDOW 39 0 136 Left 0
SYMATTR InstName C11
SYMATTR Value 10p
SYMATTR SpiceLine Rpar=1e6
SYMBOL sw 2176 160 M180
WINDOW 0 32 16 Left 0
WINDOW 3 32 80 Left 0
SYMATTR InstName S7
SYMATTR Value SH
SYMBOL sw 2176 192 R0
WINDOW 0 32 16 Left 0
WINDOW 3 32 80 Left 0
SYMATTR InstName S8
SYMATTR Value SL
SYMBOL diode 2320 144 M180
WINDOW 0 32 64 Left 0
WINDOW 3 32 0 Left 0
SYMATTR InstName D23
SYMATTR Value Dd
SYMBOL diode 2320 272 M180
WINDOW 0 32 64 Left 0
WINDOW 3 32 0 Left 0
SYMATTR InstName D24
SYMATTR Value Dd
SYMBOL zener 2400 272 M180
WINDOW 0 32 64 Left 0
WINDOW 3 32 0 Left 0
SYMATTR InstName D25
SYMATTR Value 25V
SYMBOL cap 2240 80 R0
WINDOW 0 32 0 Left 0
WINDOW 3 32 64 Left 0
SYMATTR InstName C12
SYMATTR Value 22p
SYMBOL cap 2240 208 R0
WINDOW 0 32 0 Left 0
WINDOW 3 32 64 Left 0
WINDOW 39 16 136 Left 0
SYMATTR InstName C13
SYMATTR Value 22p
SYMATTR SpiceLine Rpar=100k
SYMBOL Digital\\and 2016 -352 R0
WINDOW 0 -8 16 Center 0
WINDOW 3 40 120 Right 0
WINDOW 123 40 144 Right 0
SYMATTR InstName A10
SYMATTR Value Trise=100n
SYMATTR Value2 Tripdt=20n
SYMBOL Digital\\and 2016 112 R0
WINDOW 0 -8 16 Center 0
WINDOW 3 40 120 Right 0
WINDOW 123 40 144 Right 0
SYMATTR InstName A11
SYMATTR Value Trise=100n
SYMATTR Value2 Tripdt=20n
SYMBOL Digital\\diffschmitt 1776 -352 R0
WINDOW 0 40 32 Center 0
WINDOW 3 -32 8 Left 0
WINDOW 123 -24 120 Left 0
WINDOW 39 -24 144 Left 0
WINDOW 40 -24 168 Left 0
SYMATTR InstName A12
SYMATTR Value Vt=1.9 Vh=1
SYMATTR Value2 Trise=1110n
SYMATTR SpiceLine Tfall=100n
SYMATTR SpiceLine2 Tripdt=50n
SYMBOL nmos 832 2368 R0
SYMATTR InstName M3
SYMATTR Value IRFZ44N
SYMBOL nmos 832 2640 R0
SYMATTR InstName M4
SYMATTR Value IRFZ44N
SYMBOL res 624 2480 R0
SYMATTR InstName R5
SYMATTR Value 1k
SYMBOL res 448 2432 R90
WINDOW 0 0 56 VBottom 2
WINDOW 3 32 56 VTop 2
SYMATTR InstName R6
SYMATTR Value 10
SYMBOL diode 416 2288 R90
WINDOW 0 0 32 VBottom 2
WINDOW 3 32 32 VTop 2
SYMATTR InstName D26
SYMATTR Value 1N914
SYMBOL res 624 2768 R0
SYMATTR InstName R7
SYMATTR Value 1k
SYMBOL res 464 2720 R90
WINDOW 0 0 56 VBottom 2
WINDOW 3 32 56 VTop 2
SYMATTR InstName R8
SYMATTR Value 10
SYMBOL diode 432 2848 R90
WINDOW 0 0 32 VBottom 2
WINDOW 3 32 32 VTop 2
SYMATTR InstName D27
SYMATTR Value 1N914
SYMBOL diode -144 2224 R270
WINDOW 0 32 32 VTop 2
WINDOW 3 0 32 VBottom 2
SYMATTR InstName D28
SYMATTR Value 1N914
SYMBOL voltage 880 2160 R180
WINDOW 0 24 96 Left 2
WINDOW 3 24 16 Left 2
WINDOW 123 0 0 Left 0
WINDOW 39 24 -12 Left 2
SYMATTR InstName V5
SYMATTR Value 30
SYMATTR SpiceLine Rser=0.1
SYMBOL voltage -432 2224 R90
WINDOW 0 -32 56 VBottom 2
WINDOW 3 32 56 VTop 2
WINDOW 123 0 0 Left 0
WINDOW 39 60 56 VTop 2
SYMATTR InstName V6
SYMATTR Value 20
SYMATTR SpiceLine Rser=0.1
SYMBOL voltage -544 2464 R0
WINDOW 123 0 0 Left 0
WINDOW 39 24 124 Left 2
SYMATTR SpiceLine Rser=0.1
SYMATTR InstName V7
SYMATTR Value PULSE(5 0 33.33u 1n 1n 50u 0.1m)
SYMBOL voltage -336 2624 R0
WINDOW 123 0 0 Left 0
WINDOW 39 24 124 Left 2
SYMATTR SpiceLine Rser=0.1
SYMATTR InstName V8
SYMATTR Value 5
SYMBOL cap 64 2288 R0
SYMATTR Value 47µ
SYMATTR InstName C14
SYMATTR SpiceLine V=12.5 Irms=3.53553 Rser=0.02 Lser=0 mfg="KEMET" pn="A700D476M12RATE020" type="Al electrolytic"
SYMBOL diode 3408 -336 M180
WINDOW 0 31 64 Left 0
WINDOW 3 32 0 Left 0
SYMATTR InstName D29
SYMATTR Value Dd
SYMBOL diode 3408 -192 M180
WINDOW 0 32 64 Left 0
WINDOW 3 32 0 Left 0
SYMATTR InstName D30
SYMATTR Value Dd
SYMBOL diode 4064 -320 M180
WINDOW 0 32 64 Left 0
WINDOW 3 32 0 Left 0
SYMATTR InstName D31
SYMATTR Value Dd
SYMBOL diode 4064 -192 M180
WINDOW 0 32 64 Left 0
WINDOW 3 32 0 Left 0
SYMATTR InstName D32
SYMATTR Value Dd
SYMBOL zener 4144 -192 M180
WINDOW 0 32 64 Left 0
WINDOW 3 32 0 Left 0
SYMATTR InstName D33
SYMATTR Value 25V
SYMBOL cap 3984 -384 R0
WINDOW 0 32 0 Left 0
WINDOW 3 32 64 Left 0
SYMATTR InstName C15
SYMATTR Value 22p
SYMBOL cap 3984 -256 R0
WINDOW 0 32 0 Left 0
WINDOW 3 32 64 Left 0
WINDOW 39 16 136 Left 0
SYMATTR InstName C16
SYMATTR Value 22p
SYMATTR SpiceLine Rpar=100k
SYMBOL sw 3920 -304 M180
WINDOW 0 32 16 Left 0
WINDOW 3 32 80 Left 0
SYMATTR InstName S9
SYMATTR Value SH
SYMBOL sw 3920 -272 R0
WINDOW 0 32 16 Left 0
WINDOW 3 32 80 Left 0
SYMATTR InstName S10
SYMATTR Value SL
SYMBOL Digital\\diffschmtbuf 3792 -480 M0
WINDOW 0 40 25 Center 0
WINDOW 3 -16 25 Right 0
SYMATTR InstName A13
SYMATTR Value Vt=8.9 Vh=.35
SYMBOL cap 3328 -256 R0
WINDOW 0 32 0 Left 0
WINDOW 3 32 64 Left 0
WINDOW 39 0 136 Left 0
SYMATTR InstName C17
SYMATTR Value 10p
SYMATTR SpiceLine Rpar=1e6
SYMBOL zener 4240 -352 M270
WINDOW 0 36 32 VTop 0
WINDOW 3 -4 32 VBottom 0
SYMATTR InstName D34
SYMATTR Value 625V
SYMBOL diode 3408 128 M180
WINDOW 0 31 64 Left 0
WINDOW 3 32 0 Left 0
SYMATTR InstName D35
SYMATTR Value Dd
SYMBOL diode 3408 272 M180
WINDOW 0 32 64 Left 0
WINDOW 3 32 0 Left 0
SYMATTR InstName D36
SYMATTR Value Dd
SYMBOL Digital\\diffschmitt 3520 112 R0
WINDOW 0 40 32 Center 0
WINDOW 3 -32 8 Left 0
WINDOW 123 -24 120 Left 0
WINDOW 39 -24 144 Left 0
SYMATTR InstName A14
SYMATTR Value Vt=1.9 Vh=1
SYMATTR Value2 Trise=120n
SYMATTR SpiceLine Tripdt=25n
SYMBOL Digital\\diffschmtbuf 3792 -16 M0
WINDOW 0 40 24 Center 0
WINDOW 3 -16 24 Right 0
SYMATTR InstName A15
SYMATTR Value Vt=8.9 Vh=.35
SYMBOL cap 3328 208 R0
WINDOW 0 32 0 Left 0
WINDOW 3 32 64 Left 0
WINDOW 39 0 136 Left 0
SYMATTR InstName C18
SYMATTR Value 10p
SYMATTR SpiceLine Rpar=1e6
SYMBOL sw 3920 160 M180
WINDOW 0 32 16 Left 0
WINDOW 3 32 80 Left 0
SYMATTR InstName S11
SYMATTR Value SH
SYMBOL sw 3920 192 R0
WINDOW 0 32 16 Left 0
WINDOW 3 32 80 Left 0
SYMATTR InstName S12
SYMATTR Value SL
SYMBOL diode 4064 144 M180
WINDOW 0 32 64 Left 0
WINDOW 3 32 0 Left 0
SYMATTR InstName D37
SYMATTR Value Dd
SYMBOL diode 4064 272 M180
WINDOW 0 32 64 Left 0
WINDOW 3 32 0 Left 0
SYMATTR InstName D38
SYMATTR Value Dd
SYMBOL zener 4144 272 M180
WINDOW 0 32 64 Left 0
WINDOW 3 32 0 Left 0
SYMATTR InstName D39
SYMATTR Value 25V
SYMBOL cap 3984 80 R0
WINDOW 0 32 0 Left 0
WINDOW 3 32 64 Left 0
SYMATTR InstName C19
SYMATTR Value 22p
SYMBOL cap 3984 208 R0
WINDOW 0 32 0 Left 0
WINDOW 3 32 64 Left 0
WINDOW 39 16 136 Left 0
SYMATTR InstName C20
SYMATTR Value 22p
SYMATTR SpiceLine Rpar=100k
SYMBOL Digital\\and 3760 -352 R0
WINDOW 0 -8 16 Center 0
WINDOW 3 40 120 Right 0
WINDOW 123 40 144 Right 0
SYMATTR InstName A16
SYMATTR Value Trise=100n
SYMATTR Value2 Tripdt=20n
SYMBOL Digital\\and 3760 112 R0
WINDOW 0 -8 16 Center 0
WINDOW 3 40 120 Right 0
WINDOW 123 40 144 Right 0
SYMATTR InstName A17
SYMATTR Value Trise=100n
SYMATTR Value2 Tripdt=20n
SYMBOL Digital\\diffschmitt 3520 -352 R0
WINDOW 0 40 32 Center 0
WINDOW 3 -32 8 Left 0
WINDOW 123 -24 120 Left 0
WINDOW 39 -24 144 Left 0
WINDOW 40 -24 168 Left 0
SYMATTR InstName A18
SYMATTR Value Vt=1.9 Vh=1
SYMATTR Value2 Trise=1110n
SYMATTR SpiceLine Tfall=100n
SYMATTR SpiceLine2 Tripdt=50n
SYMBOL nmos 2096 1472 M0
SYMATTR InstName M5
SYMATTR Value IRFZ44N
SYMBOL nmos 2096 1744 M0
SYMATTR InstName M6
SYMATTR Value IRFZ44N
SYMBOL res 2304 1584 M0
SYMATTR InstName R9
SYMATTR Value 1k
SYMBOL res 2480 1536 M90
WINDOW 0 0 56 VBottom 2
WINDOW 3 32 56 VTop 2
SYMATTR InstName R10
SYMATTR Value 10
SYMBOL diode 2512 1392 M90
WINDOW 0 0 32 VBottom 2
WINDOW 3 32 32 VTop 2
SYMATTR InstName D40
SYMATTR Value 1N914
SYMBOL res 2304 1872 M0
SYMATTR InstName R11
SYMATTR Value 1k
SYMBOL res 2464 1824 M90
WINDOW 0 0 56 VBottom 2
WINDOW 3 32 56 VTop 2
SYMATTR InstName R12
SYMATTR Value 10
SYMBOL diode 2496 1952 M90
WINDOW 0 0 32 VBottom 2
WINDOW 3 32 32 VTop 2
SYMATTR InstName D41
SYMATTR Value 1N914
SYMBOL diode 3072 1328 M270
WINDOW 0 32 32 VTop 2
WINDOW 3 0 32 VBottom 2
SYMATTR InstName D42
SYMATTR Value 1N914
SYMBOL voltage 2048 1264 M180
WINDOW 0 24 96 Left 2
WINDOW 3 24 16 Left 2
WINDOW 123 0 0 Left 0
WINDOW 39 24 -12 Left 2
SYMATTR InstName V9
SYMATTR Value 30
SYMATTR SpiceLine Rser=0.1
SYMBOL voltage 3360 1328 M90
WINDOW 0 -32 56 VBottom 2
WINDOW 3 32 56 VTop 2
WINDOW 123 0 0 Left 0
WINDOW 39 60 56 VTop 2
SYMATTR InstName V10
SYMATTR Value 20
SYMATTR SpiceLine Rser=0.1
SYMBOL voltage 3472 1568 M0
WINDOW 123 0 0 Left 0
WINDOW 39 24 124 Left 2
SYMATTR SpiceLine Rser=0.1
SYMATTR InstName V11
SYMATTR Value PULSE(5 0 66.66u 1n 1n 50u 0.1m)
SYMBOL voltage 3264 1728 M0
WINDOW 123 0 0 Left 0
WINDOW 39 24 124 Left 2
SYMATTR SpiceLine Rser=0.1
SYMATTR InstName V12
SYMATTR Value 5
SYMBOL cap 2864 1392 M0
SYMATTR Value 47µ
SYMATTR InstName C21
SYMATTR SpiceLine V=12.5 Irms=3.53553 Rser=0.02 Lser=0 mfg="KEMET" pn="A700D476M12RATE020" type="Al electrolytic"
SYMBOL res 1888 1648 R90
WINDOW 0 0 56 VBottom 2
WINDOW 3 32 56 VTop 2
SYMATTR InstName R13
SYMATTR Value 10
SYMBOL ind 1760 1648 R90
WINDOW 0 5 56 VBottom 2
WINDOW 3 32 56 VTop 2
SYMATTR InstName L1
SYMATTR Value 20m
SYMBOL res 1456 1296 R0
SYMATTR InstName R14
SYMATTR Value 10
SYMBOL ind 1456 1472 R0
SYMATTR InstName L2
SYMATTR Value 20m
SYMBOL ind 1472 1888 R0
SYMATTR InstName L3
SYMATTR Value 20m
SYMBOL res 1472 2048 R0
SYMATTR InstName R15
SYMATTR Value 10
TEXT 240 -104 Center 0 ;>> IR2104 <<\nBehavioral Model\nby analog@ieee.org
TEXT -344 -536 Left 0 !.model 25V D(Ron=.5 Vfwd=.5 Vrev=25.2 Roff=25e4)\n.model 625V D(Ron=.5 Vfwd=.5 Vrev=625 Roff=12e6)\n.model Dd D(Ron=.5 Vfwd=.5)
TEXT 272 -536 Left 0 !.model SH SW(Vt=.5 Vh=-.5 Ron=42 Ilimit=.21)\n.model SL SW(Vt=.5 Vh=-.5 Ron=20 Ilimit=.36)
TEXT 880 -592 Left 0 ;* IR2104 Behavioral Model by analog@ieee.org\n.subckt IR2104 Vcc In _SD Com VB HO VS LO\nC1 Com In 10p Rpar=1e6\nD2 Com In Dd\nD1 In Vcc Dd\nA1 In Com 0 0 0 2 1 0 SCHMITT Vt=1.9 Vh=1\n+ Trise=1110n Tfall=100n Tripdt=50n\nA2 VB VS 0 0 0 0 3 0 SCHMITT Vt=8.9 Vh=.35\nA3 3 1 0 6 7 5 4 0 AND Trise=100n Tripdt=20n\nS1 HO VB 4 0 SH\nC2 HO VB 22p\nD3 HO VB Dd\nS2 HO VS 5 0 SL\nC3 HO VS 22p Rpar=100k\nD4 VS HO Dd\nD5 VS VB 25V\nD6 Com VB 625V\nC4 Com _SD 10p Rpar=1e6\nD8 Com _SD Dd\nD7 _SD Vcc Dd\nA4 _SD Com 0 0 0 0 6 0 SCHMITT Vt=1.9 Vh=1\n+ Trise=120n Tripdt=25n\nA5 Vcc Com 0 0 0 0 7 0 SCHMITT Vt=8.9 Vh=.35\nA6 7 6 0 2 0 9 8 0 AND Trise=100n Tripdt=20n\nS3 LO Vcc 8 0 SH\nC5 LO Vcc 22p\nD9 LO Vcc Dd\nS4 LO Com 9 0 SL\nC6 LO Com 22p Rpar=100k\nD10 Com LO Dd\nD11 Com Vcc 25V\n.model Dd D(Ron=.5 Vfwd=.5)\n.model 25V D(Ron=.5 Vfwd=.5 Vrev=25.2 Roff=25e4)\n.model 625V D(Ron=.5 Vfwd=.5 Vrev=625 Roff=12e6)\n.model SH SW(Vt=.5 Vh=-.5 Ron=42 Ilimit=.21)\n.model SL SW(Vt=.5 Vh=-.5 Ron=20 Ilimit=.36)\n.ends IR2104
TEXT -400 408 Left 2 !.tran 100
TEXT 2048 -104 Center 0 ;>> IR2104 <<\nBehavioral Model\nby analog@ieee.org
TEXT 1464 -536 Left 0 !.model 25V D(Ron=.5 Vfwd=.5 Vrev=25.2 Roff=25e4)\n.model 625V D(Ron=.5 Vfwd=.5 Vrev=625 Roff=12e6)\n.model Dd D(Ron=.5 Vfwd=.5)
TEXT 2080 -536 Left 0 !.model SH SW(Vt=.5 Vh=-.5 Ron=42 Ilimit=.21)\n.model SL SW(Vt=.5 Vh=-.5 Ron=20 Ilimit=.36)
TEXT 3792 -104 Center 0 ;>> IR2104 <<\nBehavioral Model\nby analog@ieee.org
TEXT 3208 -536 Left 0 !.model 25V D(Ron=.5 Vfwd=.5 Vrev=25.2 Roff=25e4)\n.model 625V D(Ron=.5 Vfwd=.5 Vrev=625 Roff=12e6)\n.model Dd D(Ron=.5 Vfwd=.5)
TEXT 3824 -536 Left 0 !.model SH SW(Vt=.5 Vh=-.5 Ron=42 Ilimit=.21)\n.model SL SW(Vt=.5 Vh=-.5 Ron=20 Ilimit=.36)
TEXT 176 416 Left 2 ;IR2104
TEXT -160 960 Left 2 ;IR2104
TEXT 2016 432 Left 2 ;IR2104-2
TEXT 3744 416 Left 2 ;IR2104-3
TEXT -144 2368 Left 2 ;IR2104-2
TEXT 2976 1472 Left 2 ;IR2104-3
RECTANGLE Normal 832 384 -384 -576
RECTANGLE Normal 2640 384 1424 -576
RECTANGLE Normal 4384 384 3168 -576

The netlist it stands for:
* IR2104_11son hal.asc
D1 In Vcc Dd
D2 0 In Dd
D3 HO VB Dd
D4 A HO Dd
D5 A VB 25V
C2 VB HO 22p
C3 HO A 22p Rpar=100k
S1 HO VB 4 0 SH
S2 HO A 5 0 SL
A2 VB A 0 0 0 0 3 0 SCHMITT Vt=8.9 Vh=.35
C1 In 0 10p Rpar=1e6
D6 0 VB 625V
D7 _SD Vcc Dd
D8 0 _SD Dd
A4 _SD 0 0 0 0 0 6 0 SCHMITT Vt=1.9 Vh=1 Trise=120n Tripdt=25n
A5 Vcc 0 0 0 0 0 7 0 SCHMITT Vt=8.9 Vh=.35
C4 _SD 0 10p Rpar=1e6
S3 LO Vcc 8 0 SH
S4 LO 0 9 0 SL
D9 LO Vcc Dd
D10 0 LO Dd
D11 0 Vcc 25V
C5 Vcc LO 22p
C6 LO 0 22p Rpar=100k
A3 3 1 0 6 7 5 4 0 AND Trise=100n Tripdt=20n
A6 7 6 0 2 0 9 8 0 AND Trise=100n Tripdt=20n
A1 In 0 0 0 0 2 1 0 SCHMITT Vt=1.9 Vh=1 Trise=1110n Tfall=100n Tripdt=50n
M1 N014 N013 A A IRFZ44N
M2 A N015 0 0 IRFZ44N
R1 N013 A 1k
R2 N013 HO 10
D12 N013 HO 1N914
R3 N015 0 1k
R4 N015 LO 10
D13 N015 LO 1N914
D14 Vcc VB 1N914
V1 N014 0 30 Rser=0.1
V2 Vcc 0 20 Rser=0.1
V3 In 0 PULSE(5 0 0 1n 1n 50u 0.1m) Rser=0.1
V4 _SD 0 5 Rser=0.1
C8 VB A 47µ V=12.5 Irms=3.53553 Rser=0.02 Lser=0 mfg="KEMET" pn="A700D476M12RATE020" type="Al electrolytic"
D15 In1 Vcc1 Dd
D16 0 In1 Dd
D17 HO1 VB1 Dd
D18 C HO1 Dd
D19 C VB1 25V
C7 VB1 HO1 22p
C9 HO1 C 22p Rpar=100k
S5 HO1 VB1 41 0 SH
S6 HO1 C 51 0 SL
A7 VB1 C 0 0 0 0 31 0 SCHMITT Vt=8.9 Vh=.35
C10 In1 0 10p Rpar=1e6
D20 0 VB1 625V
D21 _SD1 Vcc1 Dd
D22 0 _SD1 Dd
A8 _SD1 0 0 0 0 0 61 0 SCHMITT Vt=1.9 Vh=1 Trise=120n Tripdt=25n
A9 Vcc1 0 0 0 0 0 71 0 SCHMITT Vt=8.9 Vh=.35
C11 _SD1 0 10p Rpar=1e6
S7 LO1 Vcc1 81 0 SH
S8 LO1 0 91 0 SL
D23 LO1 Vcc1 Dd
D24 0 LO1 Dd
D25 0 Vcc1 25V
C12 Vcc1 LO1 22p
C13 LO1 0 22p Rpar=100k
A10 31 11 0 61 71 51 41 0 AND Trise=100n Tripdt=20n
A11 71 61 0 21 0 91 81 0 AND Trise=100n Tripdt=20n
A12 In1 0 0 0 0 21 11 0 SCHMITT Vt=1.9 Vh=1 Trise=1110n Tfall=100n Tripdt=50n
M3 N023 N022 C C IRFZ44N
M4 C N024 0 0 IRFZ44N
R5 N022 C 1k
R6 N022 HO1 10
D26 N022 HO1 1N914
R7 N024 0 1k
R8 N024 LO1 10
D27 N024 LO1 1N914
D28 Vcc1 VB1 1N914
V5 N023 0 30 Rser=0.1
V6 Vcc1 0 20 Rser=0.1
V7 In1 0 PULSE(5 0 33.33u 1n 1n 50u 0.1m) Rser=0.1
V8 _SD1 0 5 Rser=0.1
C14 VB1 C 47µ V=12.5 Irms=3.53553 Rser=0.02 Lser=0 mfg="KEMET" pn="A700D476M12RATE020" type="Al electrolytic"
D29 In2 Vcc2 Dd
D30 0 In2 Dd
D31 HO2 VB2 Dd
D32 B HO2 Dd
D33 B VB2 25V
C15 VB2 HO2 22p
C16 HO2 B 22p Rpar=100k
S9 HO2 VB2 42 0 SH
S10 HO2 B 52 0 SL
A13 VB2 B 0 0 0 0 32 0 SCHMITT Vt=8.9 Vh=.35
C17 In2 0 10p Rpar=1e6
D34 0 VB2 625V
D35 _SD2 Vcc2 Dd
D36 0 _SD2 Dd
A14 _SD2 0 0 0 0 0 62 0 SCHMITT Vt=1.9 Vh=1 Trise=120n Tripdt=25n
A15 Vcc2 0 0 0 0 0 72 0 SCHMITT Vt=8.9 Vh=.35
C18 _SD2 0 10p Rpar=1e6
S11 LO2 Vcc2 82 0 SH
S12 LO2 0 92 0 SL
D37 LO2 Vcc2 Dd
D38 0 LO2 Dd
D39 0 Vcc2 25V
C19 Vcc2 LO2 22p
C20 LO2 0 22p Rpar=100k
A16 32 12 0 62 72 52 42 0 AND Trise=100n Tripdt=20n
A17 72 62 0 22 0 92 82 0 AND Trise=100n Tripdt=20n
A18 In2 0 0 0 0 22 12 0 SCHMITT Vt=1.9 Vh=1 Trise=1110n Tfall=100n Tripdt=50n
M5 N017 N016 B B IRFZ44N
M6 B N020 0 0 IRFZ44N
R9 N016 B 1k
R10 N016 HO2 10
D40 N016 HO2 1N914
R11 N020 0 1k
R12 N020 LO2 10
D41 N020 LO2 1N914
D42 Vcc2 VB2 1N914
V9 N017 0 30 Rser=0.1
V10 Vcc2 0 20 Rser=0.1
V11 In2 0 PULSE(5 0 66.66u 1n 1n 50u 0.1m) Rser=0.1
V12 _SD2 0 5 Rser=0.1
C21 VB2 B 47µ V=12.5 Irms=3.53553 Rser=0.02 Lser=0 mfg="KEMET" pn="A700D476M12RATE020" type="Al electrolytic"
R13 B N019 10
L1 N019 N 20m
R14 A N018 10
L2 N018 N 20m
L3 N N021 20m
R15 N021 C 10
.model D D
.lib standard.dio
.model NMOS NMOS
.model PMOS PMOS
.lib standard.mos
* >> IR2104 <<
* Behavioral Model
* by analog@ieee.org
.model 25V D(Ron=.5 Vfwd=.5 Vrev=25.2 Roff=25e4)
.model 625V D(Ron=.5 Vfwd=.5 Vrev=625 Roff=12e6)
.model Dd D(Ron=.5 Vfwd=.5)
.model SH SW(Vt=.5 Vh=-.5 Ron=42 Ilimit=.21)
.model SL SW(Vt=.5 Vh=-.5 Ron=20 Ilimit=.36)
* * IR2104 Behavioral Model by analog@ieee.org
* .subckt IR2104 Vcc In _SD Com VB HO VS LO
* C1 Com In 10p Rpar=1e6
* D2 Com In Dd
* D1 In Vcc Dd
* A1 In Com 0 0 0 2 1 0 SCHMITT Vt=1.9 Vh=1
* + Trise=1110n Tfall=100n Tripdt=50n
* A2 VB VS 0 0 0 0 3 0 SCHMITT Vt=8.9 Vh=.35
* A3 3 1 0 6 7 5 4 0 AND Trise=100n Tripdt=20n
* S1 HO VB 4 0 SH
* C2 HO VB 22p
* D3 HO VB Dd
* S2 HO VS 5 0 SL
* C3 HO VS 22p Rpar=100k
* D4 VS HO Dd
* D5 VS VB 25V
* D6 Com VB 625V
* C4 Com _SD 10p Rpar=1e6
* D8 Com _SD Dd
* D7 _SD Vcc Dd
* A4 _SD Com 0 0 0 0 6 0 SCHMITT Vt=1.9 Vh=1
* + Trise=120n Tripdt=25n
* A5 Vcc Com 0 0 0 0 7 0 SCHMITT Vt=8.9 Vh=.35
* A6 7 6 0 2 0 9 8 0 AND Trise=100n Tripdt=20n
* S3 LO Vcc 8 0 SH
* C5 LO Vcc 22p
* D9 LO Vcc Dd
* S4 LO Com 9 0 SL
* C6 LO Com 22p Rpar=100k
* D10 Com LO Dd
* D11 Com Vcc 25V
* .model Dd D(Ron=.5 Vfwd=.5)
* .model 25V D(Ron=.5 Vfwd=.5 Vrev=25.2 Roff=25e4)
* .model 625V D(Ron=.5 Vfwd=.5 Vrev=625 Roff=12e6)
* .model SH SW(Vt=.5 Vh=-.5 Ron=42 Ilimit=.21)
* .model SL SW(Vt=.5 Vh=-.5 Ron=20 Ilimit=.36)
* .ends IR2104
.tran 100
* >> IR2104 <<
* Behavioral Model
* by analog@ieee.org
.model 25V D(Ron=.5 Vfwd=.5 Vrev=25.2 Roff=25e4)
.model 625V D(Ron=.5 Vfwd=.5 Vrev=625 Roff=12e6)
.model Dd D(Ron=.5 Vfwd=.5)
.model SH SW(Vt=.5 Vh=-.5 Ron=42 Ilimit=.21)
.model SL SW(Vt=.5 Vh=-.5 Ron=20 Ilimit=.36)
* >> IR2104 <<
* Behavioral Model
* by analog@ieee.org
.model 25V D(Ron=.5 Vfwd=.5 Vrev=25.2 Roff=25e4)
.model 625V D(Ron=.5 Vfwd=.5 Vrev=625 Roff=12e6)
.model Dd D(Ron=.5 Vfwd=.5)
.model SH SW(Vt=.5 Vh=-.5 Ron=42 Ilimit=.21)
.model SL SW(Vt=.5 Vh=-.5 Ron=20 Ilimit=.36)
* IR2104
* IR2104
* IR2104-2
* IR2104-3
* IR2104-2
* IR2104-3
.backanno
.end